# Altium schematic sheet memory.SchDoc: Activity Tracker - Memory
size A4; DrawnBy: Lukas Gasser; DocumentNumber: 2; SheetNumber: 2; SheetTotal: 3
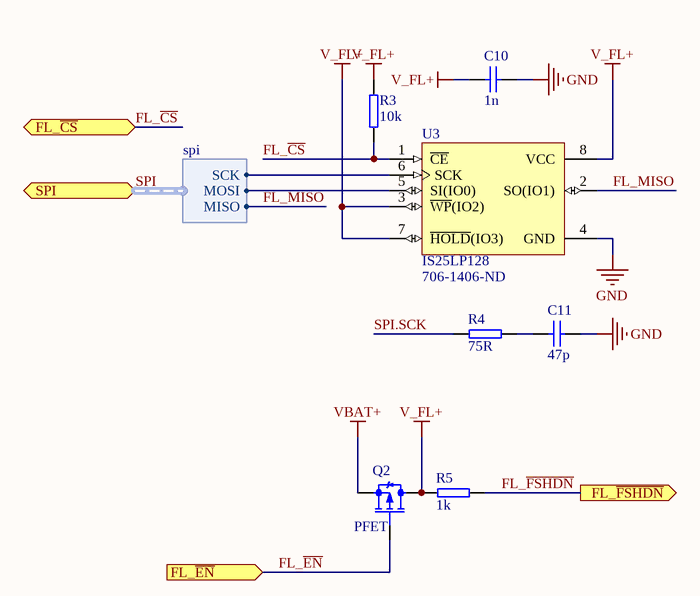
[diagram p0: memory.SchDoc]

## Parts
C10  1n  [CAPC1608X95N]
C11  47p  [CAPC1608X95N]
Q2  PFET  [SOT95P237X112-3N]
R3  10k  [RESC1608X55N]
R4  75R  [RESC1608X55N]
R5  1k  [RESC1608X55N]
U3  IS25LP128  Supplier Part Number 1: 706-1406-ND  [QFN127P500X600X80-8M_MIN_EP]

## Ports
FL_~{CS}, FL_~{EN} (in), FL_~{FSHDN} (out), SPI (harness spi)

## Harnesses
spi: MISO, SCK, MOSI

## Nets
GND: C10.1 C11.2 U3.4(GND)
V_FL+: C10.2 Q2.3(D) R3.2 R5.1 U3.3(~{WP}(IO2)) U3.7(~{HOLD}(IO3)) U3.8(VCC)
VBAT+: Q2.2(S)
FL_~{CS}: R3.1 U3.1(~{CE}) ; port FL_~{CS}
FL_~{EN}: Q2.1(G) ; port FL_~{EN}
FL_~{FSHDN}: R5.2 ; port FL_~{FSHDN}
FL_MISO: U3.2(SO(IO1)) ; port SPI.MISO
SPI.MOSI: U3.5(SI(IO0)) ; port SPI.MOSI
SPI.SCK: R4.1
SPI.SCK: U3.6(SCK) ; port SPI.SCK  [a separate net that carries the same name]
NetC11_1: C11.1 R4.2

## Buses and harness runs
harness SPI = port SPI

## Library data of the parts
C10 C11 = C: Capacitor; Voltage: 50V; Supplier 1: Digi-Key
  C10: Value: 1n; Supplier Part Number 1: 478-1215-1-ND
  C11: Value: 47p; Supplier Part Number 1: 1276-1037-1-ND
Q2 = IRLML2246TRPBF: P-Channel MOSFET, 20V 2.6A; ClassName: directConnect; Supplier 1: Digi-Key; Supplier Part Number 1: IRLML2246TRPBFCT-ND
R3-R5 = R: Resistor; Supplier 1: Digi-Key
  R3: Value: 10k; Supplier Part Number 1: 311-10KGRCT-ND
  R4: Value: 75R; Supplier Part Number 1: RHM75.0CFCT-ND
  R5: Value: 1k; Supplier Part Number 1: 1276-5062-1-ND
U3 = IS25LP128: 3V SERIAL FLASH MEMORY WITH 133MHZ MULTI  I/O   SPI & QUAD I/O QPI DTR INTERFACE; ClassName: directConnect; Supplier 1: Digi-Key